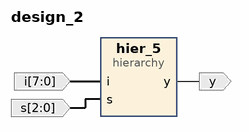
[diagram p0: block diagram of the top level]
# Vivado block design design_2, xc7a100tcsg324-1, Vivado 2024.2
create_bd_design design_2

create_bd_port -dir O y
create_bd_port -dir I -from 7 -to 0 i
create_bd_port -dir I -from 2 -to 0 s

create_bd_cell -type hier hier_5

# ---- hierarchy /hier_5 ----
current_bd_instance /hier_5
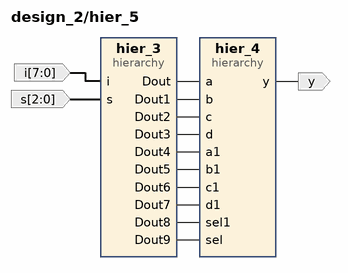
[diagram p1: block diagram inside /hier_5]
create_bd_pin -dir O y
create_bd_pin -dir I -from 7 -to 0 i
create_bd_pin -dir I -from 2 -to 0 s

create_bd_cell -type hier hier_4
create_bd_cell -type hier hier_3

# ---- hierarchy /hier_5/hier_4 ----
current_bd_instance /hier_5/hier_4
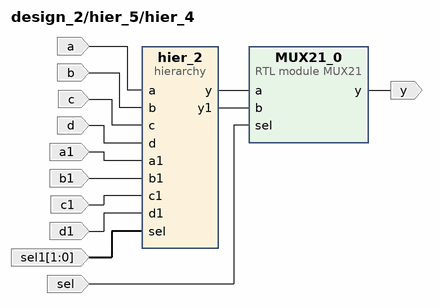
[diagram p2: block diagram inside /hier_5/hier_4]
create_bd_pin -dir I sel
create_bd_pin -dir O y
create_bd_pin -dir I a
create_bd_pin -dir I b
create_bd_pin -dir I c
create_bd_pin -dir I d
create_bd_pin -dir I -from 1 -to 0 sel1
create_bd_pin -dir I a1
create_bd_pin -dir I b1
create_bd_pin -dir I c1
create_bd_pin -dir I d1

create_bd_cell -type module -reference MUX21 MUX21_0
create_bd_cell -type hier hier_2

# ---- hierarchy /hier_5/hier_4/hier_2 ----
current_bd_instance /hier_5/hier_4/hier_2
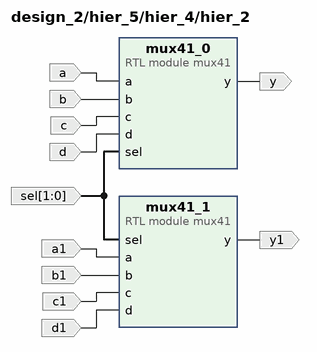
[diagram p3: block diagram inside /hier_5/hier_4/hier_2]
create_bd_pin -dir I a
create_bd_pin -dir I b
create_bd_pin -dir I c
create_bd_pin -dir I d
create_bd_pin -dir I -from 1 -to 0 sel
create_bd_pin -dir O y
create_bd_pin -dir I a1
create_bd_pin -dir I b1
create_bd_pin -dir I c1
create_bd_pin -dir I d1
create_bd_pin -dir O y1

create_bd_cell -type module -reference mux41 mux41_0
create_bd_cell -type module -reference mux41 mux41_1

# ---- hierarchy /hier_5/hier_3 ----
current_bd_instance /hier_5/hier_3
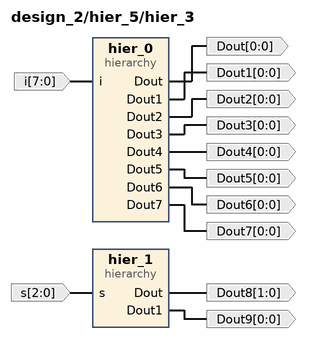
[diagram p4: block diagram inside /hier_5/hier_3]
create_bd_pin -dir I -from 7 -to 0 i
create_bd_pin -dir O -from 0 -to 0 Dout
create_bd_pin -dir O -from 0 -to 0 Dout1
create_bd_pin -dir O -from 0 -to 0 Dout2
create_bd_pin -dir O -from 0 -to 0 Dout3
create_bd_pin -dir O -from 0 -to 0 Dout4
create_bd_pin -dir O -from 0 -to 0 Dout5
create_bd_pin -dir O -from 0 -to 0 Dout6
create_bd_pin -dir O -from 0 -to 0 Dout7
create_bd_pin -dir I -from 2 -to 0 s
create_bd_pin -dir O -from 1 -to 0 Dout8
create_bd_pin -dir O -from 0 -to 0 Dout9

create_bd_cell -type hier hier_0
create_bd_cell -type hier hier_1

# ---- hierarchy /hier_5/hier_3/hier_0 ----
current_bd_instance /hier_5/hier_3/hier_0
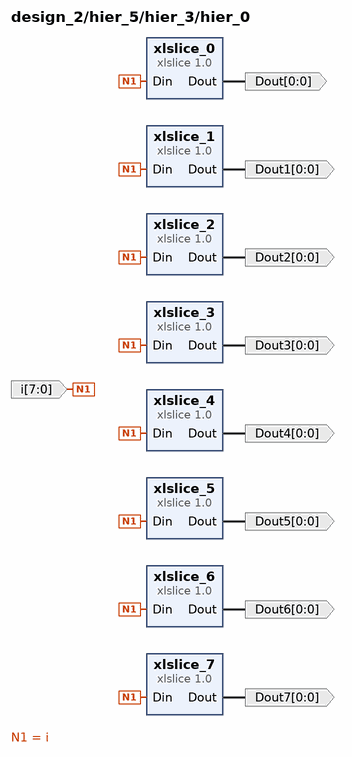
[diagram p5: block diagram inside /hier_5/hier_3/hier_0]
create_bd_pin -dir I -from 7 -to 0 i
create_bd_pin -dir O -from 0 -to 0 Dout
create_bd_pin -dir O -from 0 -to 0 Dout1
create_bd_pin -dir O -from 0 -to 0 Dout2
create_bd_pin -dir O -from 0 -to 0 Dout3
create_bd_pin -dir O -from 0 -to 0 Dout4
create_bd_pin -dir O -from 0 -to 0 Dout5
create_bd_pin -dir O -from 0 -to 0 Dout6
create_bd_pin -dir O -from 0 -to 0 Dout7

create_bd_cell -type ip -vlnv xilinx.com:ip:xlslice:1.0 xlslice_0
set_property -dict {CONFIG.DIN_FROM 7 CONFIG.DIN_TO 7 CONFIG.DIN_WIDTH 8} [get_bd_cells xlslice_0]
create_bd_cell -type ip -vlnv xilinx.com:ip:xlslice:1.0 xlslice_1
set_property -dict {CONFIG.DIN_FROM 6 CONFIG.DIN_TO 6 CONFIG.DIN_WIDTH 8} [get_bd_cells xlslice_1]
create_bd_cell -type ip -vlnv xilinx.com:ip:xlslice:1.0 xlslice_2
set_property -dict {CONFIG.DIN_FROM 5 CONFIG.DIN_TO 5 CONFIG.DIN_WIDTH 8} [get_bd_cells xlslice_2]
create_bd_cell -type ip -vlnv xilinx.com:ip:xlslice:1.0 xlslice_3
set_property -dict {CONFIG.DIN_FROM 4 CONFIG.DIN_TO 4 CONFIG.DIN_WIDTH 8} [get_bd_cells xlslice_3]
create_bd_cell -type ip -vlnv xilinx.com:ip:xlslice:1.0 xlslice_4
set_property -dict {CONFIG.DIN_FROM 3 CONFIG.DIN_TO 3 CONFIG.DIN_WIDTH 8} [get_bd_cells xlslice_4]
create_bd_cell -type ip -vlnv xilinx.com:ip:xlslice:1.0 xlslice_5
set_property -dict {CONFIG.DIN_FROM 2 CONFIG.DIN_TO 2 CONFIG.DIN_WIDTH 8} [get_bd_cells xlslice_5]
create_bd_cell -type ip -vlnv xilinx.com:ip:xlslice:1.0 xlslice_6
set_property -dict {CONFIG.DIN_FROM 1 CONFIG.DIN_TO 1 CONFIG.DIN_WIDTH 8} [get_bd_cells xlslice_6]
create_bd_cell -type ip -vlnv xilinx.com:ip:xlslice:1.0 xlslice_7
set_property -dict {CONFIG.DIN_FROM 0 CONFIG.DIN_TO 0 CONFIG.DIN_WIDTH 8} [get_bd_cells xlslice_7]

# ---- hierarchy /hier_5/hier_3/hier_1 ----
current_bd_instance /hier_5/hier_3/hier_1
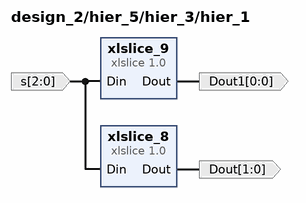
[diagram p6: block diagram inside /hier_5/hier_3/hier_1]
create_bd_pin -dir I -from 2 -to 0 s
create_bd_pin -dir O -from 1 -to 0 Dout
create_bd_pin -dir O -from 0 -to 0 Dout1

create_bd_cell -type ip -vlnv xilinx.com:ip:xlslice:1.0 xlslice_8
set_property -dict {CONFIG.DIN_FROM 1 CONFIG.DIN_TO 0 CONFIG.DIN_WIDTH 3} [get_bd_cells xlslice_8]
create_bd_cell -type ip -vlnv xilinx.com:ip:xlslice:1.0 xlslice_9
set_property -dict {CONFIG.DIN_FROM 2 CONFIG.DIN_TO 2 CONFIG.DIN_WIDTH 3} [get_bd_cells xlslice_9]

# ---- connections ----

current_bd_instance /hier_5
connect_bd_net -net MUX21_0_y [get_bd_pins hier_4/y] [get_bd_pins y]
connect_bd_net [get_bd_pins i] [get_bd_pins hier_3/i]
connect_bd_net [get_bd_pins s] [get_bd_pins hier_3/s]
connect_bd_net -net xlslice_0_Dout [get_bd_pins hier_3/Dout] [get_bd_pins hier_4/a]
connect_bd_net -net xlslice_1_Dout [get_bd_pins hier_3/Dout1] [get_bd_pins hier_4/b]
connect_bd_net -net xlslice_2_Dout [get_bd_pins hier_3/Dout2] [get_bd_pins hier_4/c]
connect_bd_net -net xlslice_3_Dout [get_bd_pins hier_3/Dout3] [get_bd_pins hier_4/d]
connect_bd_net -net xlslice_4_Dout [get_bd_pins hier_3/Dout4] [get_bd_pins hier_4/a1]
connect_bd_net -net xlslice_5_Dout [get_bd_pins hier_3/Dout5] [get_bd_pins hier_4/b1]
connect_bd_net -net xlslice_6_Dout [get_bd_pins hier_3/Dout6] [get_bd_pins hier_4/c1]
connect_bd_net -net xlslice_7_Dout [get_bd_pins hier_3/Dout7] [get_bd_pins hier_4/d1]
connect_bd_net -net xlslice_8_Dout [get_bd_pins hier_3/Dout8] [get_bd_pins hier_4/sel1]
connect_bd_net -net xlslice_9_Dout [get_bd_pins hier_3/Dout9] [get_bd_pins hier_4/sel]

current_bd_instance /hier_5/hier_4
connect_bd_net [get_bd_pins MUX21_0/y] [get_bd_pins y]
connect_bd_net -net mux41_0_y [get_bd_pins hier_2/y] [get_bd_pins MUX21_0/a]
connect_bd_net -net mux41_1_y [get_bd_pins hier_2/y1] [get_bd_pins MUX21_0/b]
connect_bd_net -net xlslice_0_Dout [get_bd_pins a] [get_bd_pins hier_2/a]
connect_bd_net -net xlslice_1_Dout [get_bd_pins b] [get_bd_pins hier_2/b]
connect_bd_net -net xlslice_2_Dout [get_bd_pins c] [get_bd_pins hier_2/c]
connect_bd_net -net xlslice_3_Dout [get_bd_pins d] [get_bd_pins hier_2/d]
connect_bd_net -net xlslice_4_Dout [get_bd_pins a1] [get_bd_pins hier_2/a1]
connect_bd_net -net xlslice_5_Dout [get_bd_pins b1] [get_bd_pins hier_2/b1]
connect_bd_net -net xlslice_6_Dout [get_bd_pins c1] [get_bd_pins hier_2/c1]
connect_bd_net -net xlslice_7_Dout [get_bd_pins d1] [get_bd_pins hier_2/d1]
connect_bd_net -net xlslice_8_Dout [get_bd_pins sel1] [get_bd_pins hier_2/sel]
connect_bd_net -net xlslice_9_Dout [get_bd_pins sel] [get_bd_pins MUX21_0/sel]

current_bd_instance /hier_5/hier_4/hier_2
connect_bd_net [get_bd_pins mux41_0/y] [get_bd_pins y]
connect_bd_net [get_bd_pins mux41_1/y] [get_bd_pins y1]
connect_bd_net -net xlslice_0_Dout [get_bd_pins a] [get_bd_pins mux41_0/a]
connect_bd_net -net xlslice_1_Dout [get_bd_pins b] [get_bd_pins mux41_0/b]
connect_bd_net -net xlslice_2_Dout [get_bd_pins c] [get_bd_pins mux41_0/c]
connect_bd_net -net xlslice_3_Dout [get_bd_pins d] [get_bd_pins mux41_0/d]
connect_bd_net -net xlslice_4_Dout [get_bd_pins a1] [get_bd_pins mux41_1/a]
connect_bd_net -net xlslice_5_Dout [get_bd_pins b1] [get_bd_pins mux41_1/b]
connect_bd_net -net xlslice_6_Dout [get_bd_pins c1] [get_bd_pins mux41_1/c]
connect_bd_net -net xlslice_7_Dout [get_bd_pins d1] [get_bd_pins mux41_1/d]
connect_bd_net -net xlslice_8_Dout [get_bd_pins sel] [get_bd_pins mux41_1/sel] [get_bd_pins mux41_0/sel]

current_bd_instance /hier_5/hier_3
connect_bd_net [get_bd_pins i] [get_bd_pins hier_0/i]
connect_bd_net [get_bd_pins s] [get_bd_pins hier_1/s]
connect_bd_net -net xlslice_0_Dout [get_bd_pins hier_0/Dout] [get_bd_pins Dout]
connect_bd_net -net xlslice_1_Dout [get_bd_pins hier_0/Dout1] [get_bd_pins Dout1]
connect_bd_net -net xlslice_2_Dout [get_bd_pins hier_0/Dout2] [get_bd_pins Dout2]
connect_bd_net -net xlslice_3_Dout [get_bd_pins hier_0/Dout3] [get_bd_pins Dout3]
connect_bd_net -net xlslice_4_Dout [get_bd_pins hier_0/Dout4] [get_bd_pins Dout4]
connect_bd_net -net xlslice_5_Dout [get_bd_pins hier_0/Dout5] [get_bd_pins Dout5]
connect_bd_net -net xlslice_6_Dout [get_bd_pins hier_0/Dout6] [get_bd_pins Dout6]
connect_bd_net -net xlslice_7_Dout [get_bd_pins hier_0/Dout7] [get_bd_pins Dout7]
connect_bd_net -net xlslice_8_Dout [get_bd_pins hier_1/Dout] [get_bd_pins Dout8]
connect_bd_net -net xlslice_9_Dout [get_bd_pins hier_1/Dout1] [get_bd_pins Dout9]

current_bd_instance /hier_5/hier_3/hier_0
connect_bd_net [get_bd_pins i] \
  [get_bd_pins xlslice_1/Din] [get_bd_pins xlslice_2/Din] [get_bd_pins xlslice_3/Din] [get_bd_pins xlslice_4/Din] \
  [get_bd_pins xlslice_5/Din] [get_bd_pins xlslice_6/Din] [get_bd_pins xlslice_7/Din] [get_bd_pins xlslice_0/Din]
connect_bd_net [get_bd_pins xlslice_0/Dout] [get_bd_pins Dout]
connect_bd_net [get_bd_pins xlslice_1/Dout] [get_bd_pins Dout1]
connect_bd_net [get_bd_pins xlslice_2/Dout] [get_bd_pins Dout2]
connect_bd_net [get_bd_pins xlslice_3/Dout] [get_bd_pins Dout3]
connect_bd_net [get_bd_pins xlslice_4/Dout] [get_bd_pins Dout4]
connect_bd_net [get_bd_pins xlslice_5/Dout] [get_bd_pins Dout5]
connect_bd_net [get_bd_pins xlslice_6/Dout] [get_bd_pins Dout6]
connect_bd_net [get_bd_pins xlslice_7/Dout] [get_bd_pins Dout7]

current_bd_instance /hier_5/hier_3/hier_1
connect_bd_net [get_bd_pins s] [get_bd_pins xlslice_9/Din] [get_bd_pins xlslice_8/Din]
connect_bd_net [get_bd_pins xlslice_8/Dout] [get_bd_pins Dout]
connect_bd_net [get_bd_pins xlslice_9/Dout] [get_bd_pins Dout1]

current_bd_instance /
connect_bd_net -net MUX21_0_y [get_bd_pins hier_5/y] [get_bd_ports y]
connect_bd_net [get_bd_ports i] [get_bd_pins hier_5/i]
connect_bd_net [get_bd_ports s] [get_bd_pins hier_5/s]

validate_bd_design
save_bd_design
